# Altium schematic sheet 12V_LS.SchDoc
size A4
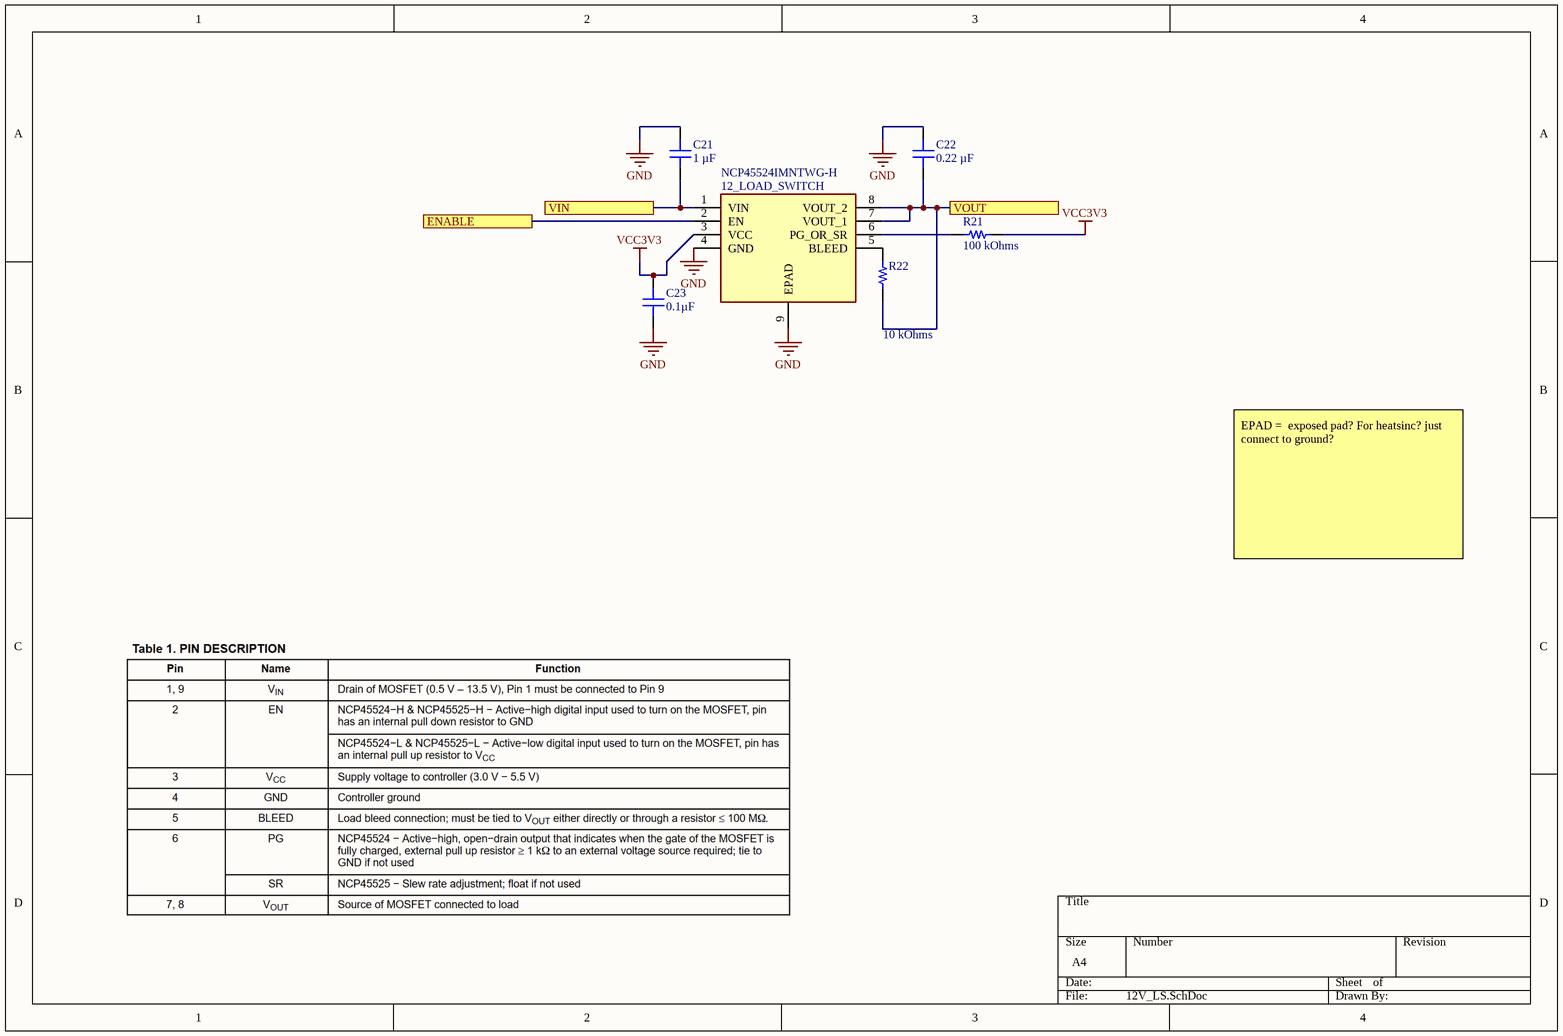
[diagram p0: 12V_LS.SchDoc]

## Parts
12_LOAD_SWITCH  NCP45524IMNTWG-H  [SON50P200X200X100-9N]
C21  1 µF  [CAP 0402_1005]
C22  0.22 µF  [CAP 0603_1608]
C23  0.1µF  [CAP 0402_1005]
R21  100 kOhms  [RES 0603_1608]
R22  10 kOhms  [RES 0603_1608]

## Ports
ENABLE, VIN, VOUT

## Nets
GND: 12_LOAD_SWITCH.4(GND) 12_LOAD_SWITCH.9(EPAD) C21.2 C22.2 C23.1
VCC3V3: 12_LOAD_SWITCH.3(VCC) C23.2 R21.2
ENABLE: 12_LOAD_SWITCH.2(EN) ; port ENABLE
VIN: 12_LOAD_SWITCH.1(VIN) C21.1 ; port VIN
VOUT: 12_LOAD_SWITCH.7(VOUT_1) 12_LOAD_SWITCH.8(VOUT_2) C22.1 R22.1 ; port VOUT
Net12_LOAD_SWITCH_5: 12_LOAD_SWITCH.5(BLEED) R22.2
Net12_LOAD_SWITCH_6: 12_LOAD_SWITCH.6(PG_OR_SR) R21.1

## Notes on the sheet
- EPAD =  exposed pad? For heatsinc? just connect to ground?

## Library data of the parts
12_LOAD_SWITCH = NCP45524IMNTWG-H: Integrated Circuit; Manufacturer_Name: onsemi; Datasheet Link: http://www.onsemi.com/pub/Collateral/NCP45524-D.PDF; Height: 1mm; Manufacturer_Part_Number: NCP45524IMNTWG-H; Mouser Part Number: 863-NCP45524IMNTWG-H; Mouser Price/Stock: https://www.mouser.co.uk/ProductDetail/onsemi/NCP45524IMNTWG-H?qs=xGcJQ%252BnsJwsBahshTeqn2Q%3D%3D; Arrow Part Number: NCP45524IMNTWG-H; Arrow Price/Stock: https://www.arrow.com/en/products/ncp45524imntwg-h/on-semiconductor
C21 = GRM155C71A105KE11D: CAP CER 1UF 10V X7S 0402; manufacturer: Murata Electronics; Tolerance: ±10%; Part Number: GRM155C71A105KE11D; Value: 1 µF; Applications: General Purpose; Capacitance: 1 µF; componentlink1description: Datasheet; componentlink1url: https://search.murata.co.jp/Ceramy/image/img/A01X/G101/ENG/GRM155C71A105KE11-01.pdf; componentlink2description: DigiKey Link; componentlink2url: https://www.digikey.com/en/products/detail/murata-electronics/GRM155C71A105KE11D/6606086; Device Package: 0402 (1005 Metric); lastupdated: 2023-06-04 7:05:15 PM; Lifecycle Status: Active; Minimum Order: 1; Mounting Type: Surface Mount, MLCC; Operating Temperature: -55°C ~ 125°C; Package / Case: 0402 (1005 Metric); packaging: TapeAndReel; partid: 1749; Part Status: Active; price: 0.01; series: GRM; Size / Dimension: 0.039" L x 0.020" W (1.00mm x 0.50mm); Supplier 1: DigiKey; Supplier Part Number 1: 490-14457-1-ND; Temperature Coefficient: X7S; Thickness (Max): 0.024" (0.60mm); Voltage - Rated: 10V
C22 = CC0603KRX7R8BB224: CAP CER 0.22UF 25V X7R 0603; manufacturer: Yageo; Tolerance: ±10%; Part Number: CC0603KRX7R8BB224; Value: 0.22 µF; Applications: General Purpose; Capacitance: 0.22 µF; componentlink1description: Datasheet; componentlink1url: https://www.yageo.com/upload/media/product/productsearch/datasheet/mlcc/UPY-GPHC_X7R_6.3V-to-50V_18.pdf; componentlink2description: DigiKey Link; componentlink2url: https://www.digikey.com/en/products/detail/yageo/CC0603KRX7R8BB224/5195211; Device Package: 0603 (1608 Metric); lastupdated: 2023-06-21 7:13:30 PM; Lifecycle Status: Active; Minimum Order: 1; Mounting Type: Surface Mount, MLCC; Operating Temperature: -55°C ~ 125°C; Package / Case: 0603 (1608 Metric); packaging: TapeAndReel; partid: 2214; Part Status: Active; price: 0.01; series: CC; Size / Dimension: 0.063" L x 0.031" W (1.60mm x 0.80mm); Supplier 1: DigiKey; Supplier Part Number 1: 311-1803-1-ND; Temperature Coefficient: X7R; Thickness (Max): 0.035" (0.90mm); Voltage - Rated: 25V
C23 = 0402ZC104KAT2A: CAP CER 0.1UF 10V X7R 0402; manufacturer: AVX Corporation; Tolerance: ±10%; Part Number: 0402ZC104KAT2A; Value: 0.1µF; Applications: General Purpose; Capacitance: 0.1µF; componentlink1description: Datasheet; componentlink1url: http://datasheets.avx.com/X7RDielectric.pdf; componentlink2description: DigiKey Link; componentlink2url: http://digikey.com/product-detail/en/avx-corporation/0402ZC104KAT2A/478-7891-1-ND/3881514; Device Package: 0402 (1005 Metric); lastupdated: 2022-02-08 12:26:59 PM; Lifecycle Status: Active; Minimum Order: 1; Mounting Type: Surface Mount, MLCC; Operating Temperature: -55°C ~ 125°C; Package / Case: 0402 (1005 Metric); packaging: TapeAndReel; partid: 1757; Part Status: Active; price: 0.09; series: -; Size / Dimension: 0.039" L x 0.020" W (1.00mm x 0.50mm); Supplier 1: DigiKey; Supplier Part Number 1: 478-7891-1-ND; Temperature Coefficient: X7R; Thickness (Max): 0.022" (0.55mm); Voltage - Rated: 10V
R21 = RNCS0603BKE100K: RES 100K OHM 0.1% 1/16W 0603; Manufacturer: Stackpole Electronics Inc; Power (Watts): 0.063W, 1/16W; Temperature Coefficient: ±25ppm/°C; Part Number: RNCS0603BKE100K; Value: 100 kOhms; ComponentLink1Description: Datasheet; ComponentLink1URL: https://www.seielect.com/catalog/sei-rncs_rnch.pdf; ComponentLink2Description: DigiKey Link; ComponentLink2URL: https://www.digikey.com/en/products/detail/stackpole-electronics-inc/RNCS0603BKE100K/1708835; Composition: Thin Film; Device Package: 0603 (1608 Metric); Features: Anti-Corrosive, Automotive AEC-Q200, Moisture Resistant; Height - Seated (Max): 0.022" (0.55mm); LastUpdated: 2023-06-04 7:36:27 PM; Lifecycle Status: Active; Minimum Order: 1; Number of Terminations: 2; Operating Temperature: -55°C ~ 155°C; Package / Case: 0603 (1608 Metric); Packaging: TapeAndReel; PartId: 4849; Part Status: Active; Price: 0.07; Ratings: AEC-Q200; Resistance: 100 kOhms; Series: RNCS; Size / Dimension: 0.061" L x 0.031" W (1.55mm x 0.80mm); Supplier 1: DigiKey; Supplier Part Number 1: RNCS0603BKE100KCT-ND; Supplier Device Package: 0603; Tolerance: ±0.1%
R22 = RNCS0603BKE10K0: RES 10K OHM 0.1% 1/16W 0603; Manufacturer: Stackpole Electronics Inc; Power (Watts): 0.063W, 1/16W; Temperature Coefficient: ±25ppm/°C; Part Number: RNCS0603BKE10K0; Value: 10 kOhms; ComponentLink1Description: Datasheet; ComponentLink1URL: https://www.seielect.com/catalog/sei-rncs_rnch.pdf; ComponentLink2Description: DigiKey Link; ComponentLink2URL: https://www.digikey.com/en/products/detail/stackpole-electronics-inc/RNCS0603BKE10K0/1708836; Composition: Thin Film; Device Package: 0603 (1608 Metric); Features: Anti-Corrosive, Automotive AEC-Q200, Moisture Resistant; Height - Seated (Max): 0.022" (0.55mm); LastUpdated: 2023-06-04 7:36:27 PM; Lifecycle Status: Active; Minimum Order: 1; Number of Terminations: 2; Operating Temperature: -55°C ~ 155°C; Package / Case: 0603 (1608 Metric); Packaging: TapeAndReel; PartId: 4838; Part Status: Active; Price: 0.07; Ratings: AEC-Q200; Resistance: 10 kOhms; Series: RNCS; Size / Dimension: 0.061" L x 0.031" W (1.55mm x 0.80mm); Supplier 1: DigiKey; Supplier Part Number 1: RNCS0603BKE10K0CT-ND; Supplier Device Package: 0603; Tolerance: ±0.1%